# EasyEDA schematic SCH_EEE3088F-Sphora_2025-04-07.json
TITLE: Sheet_1; REV: 1.0; Date: 2025-04-07; Sheet: 1/1; Drawn By: LBTTED001; Company: Your Company
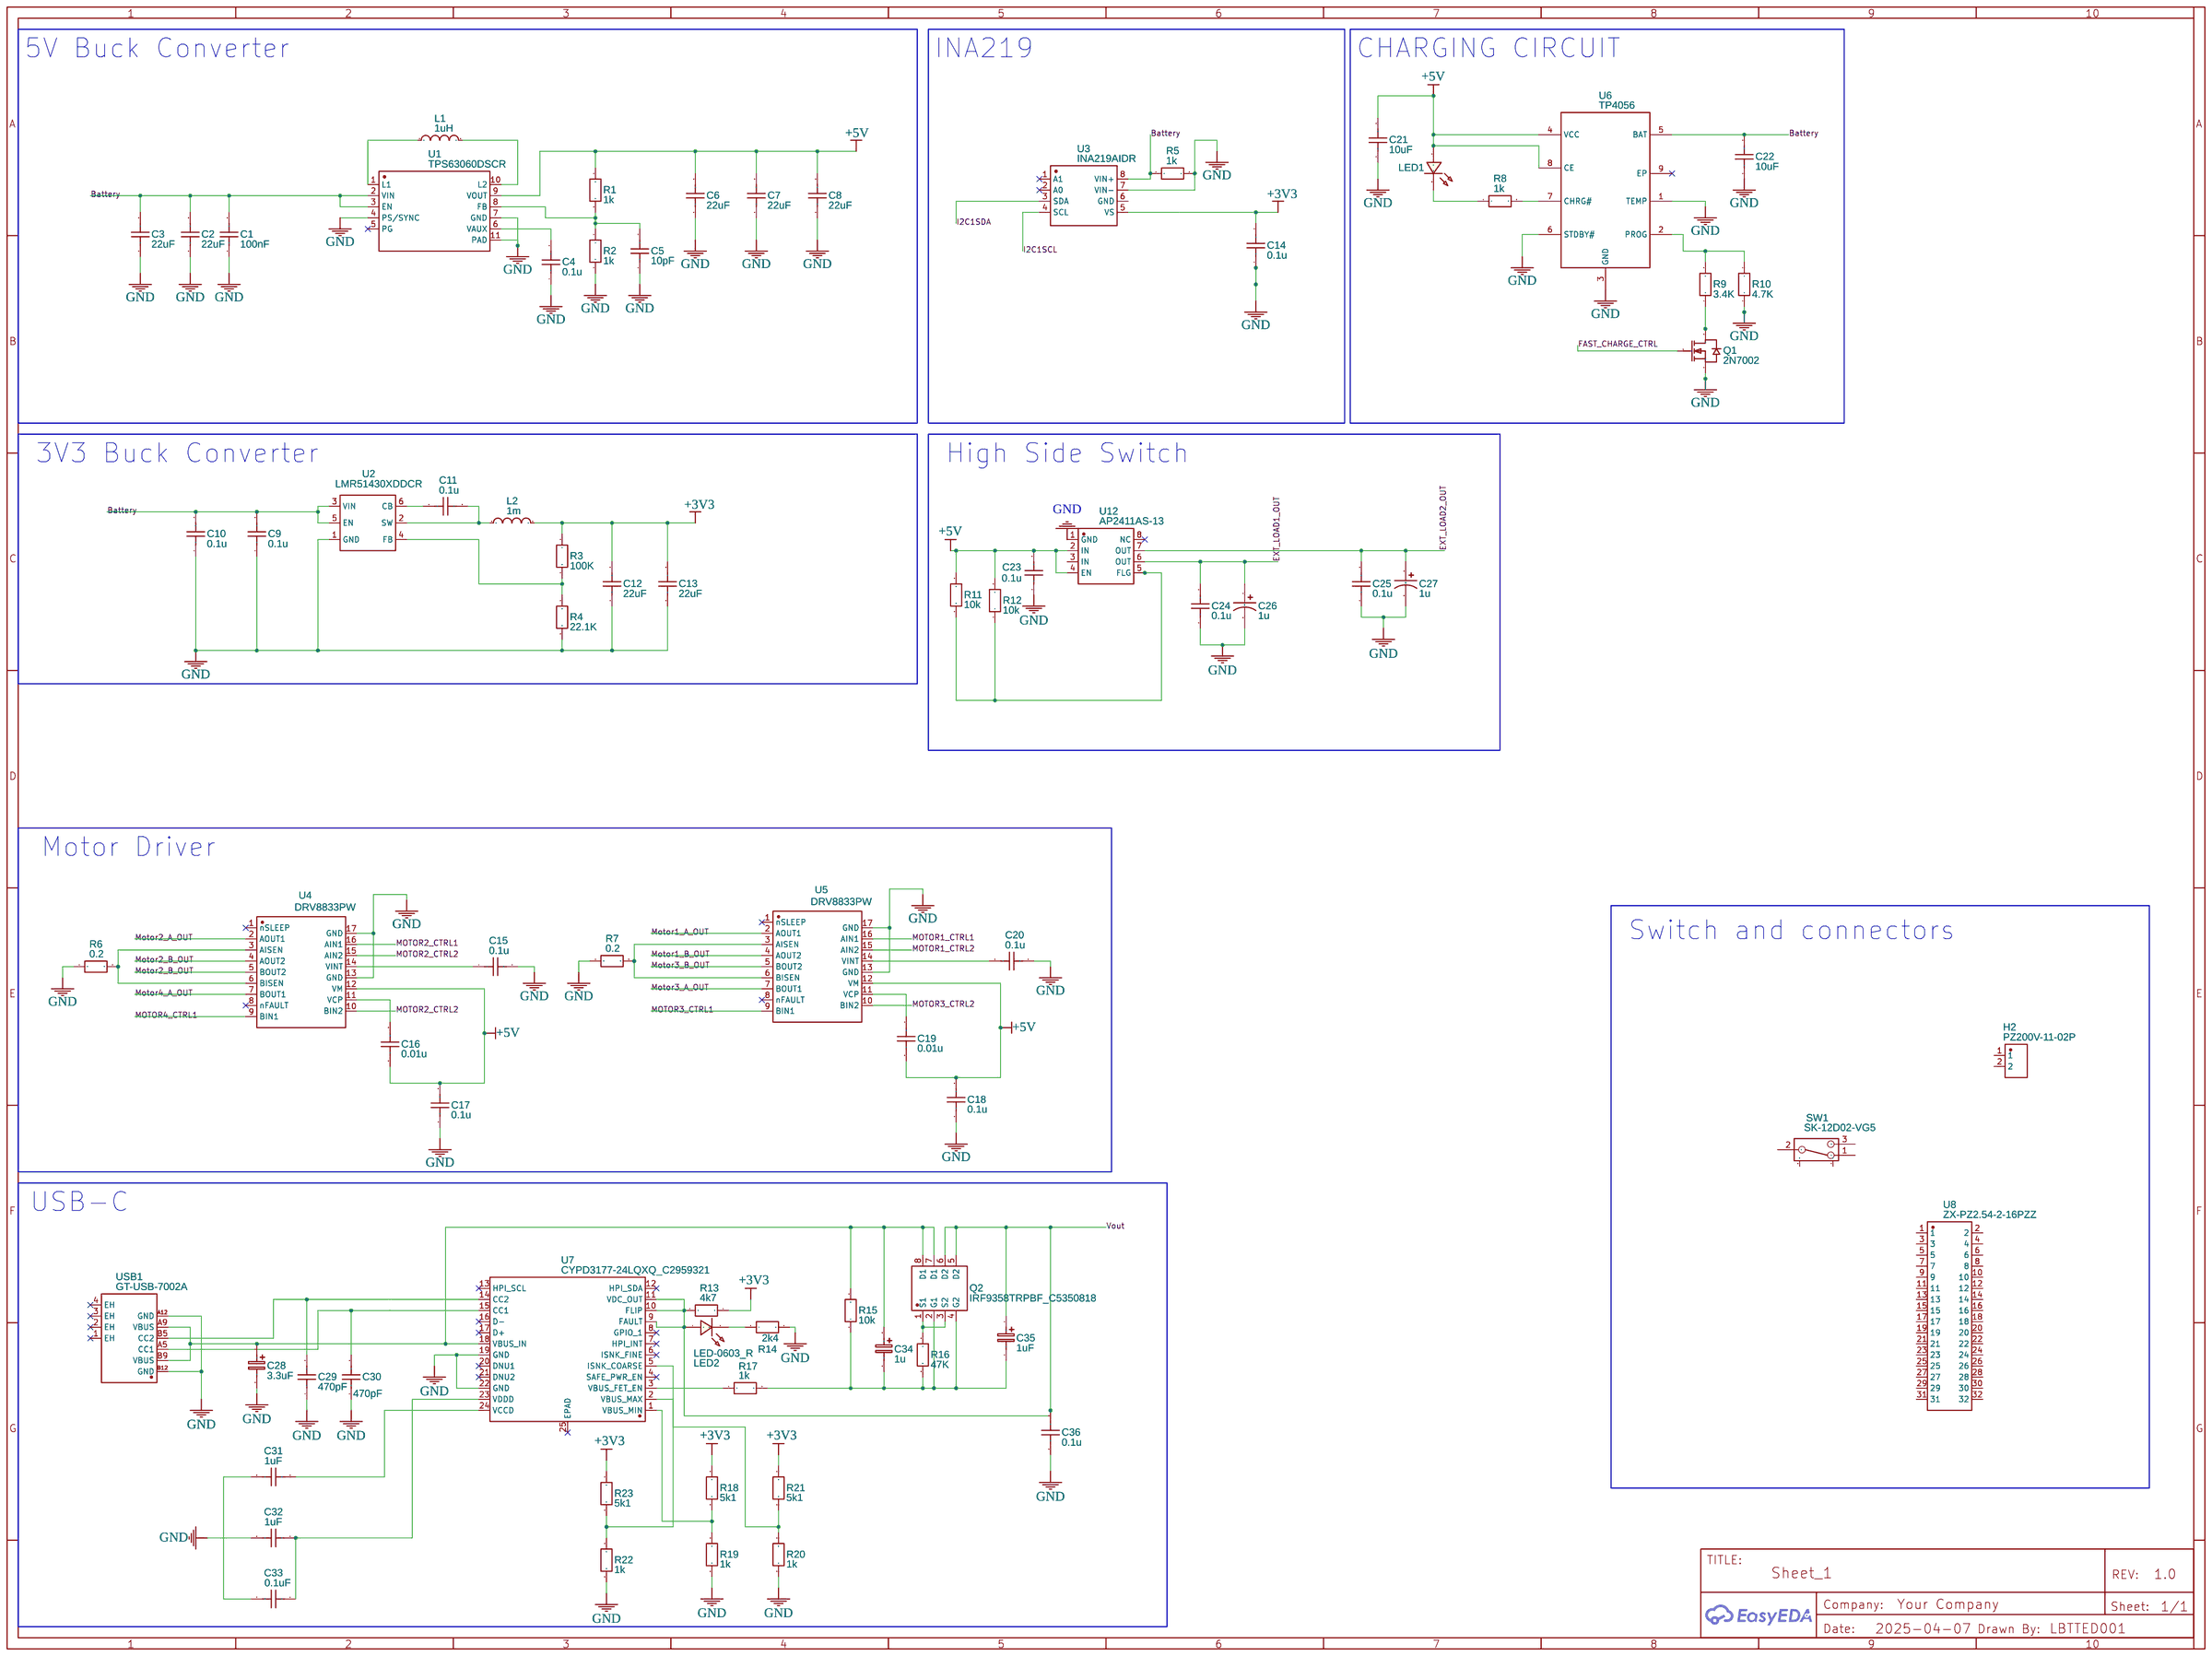
[diagram p0: schematic sheet]

## Parts
C1  100nF  [C0402]
C2  22uF  [C0402]
C3  22uF  [C0402]
C4  0.1u  [C0402]
C5  10pF  [C0402]
C6  22uF  [C0402]
C7  22uF  [C0402]
C8  22uF  [C0402]
C9  0.1u  [C0402]
C10  0.1u  [C0402]
C11  0.1u  [C0402]
C12  22uF  [C0402]
C13  22uF  [C0402]
C14  0.1u  [C0402]
C15  0.1u  [C0402]
C16  0.01u  [C0402]
C17  0.1u  [C0402]
C18  0.1u  [C0402]
C19  0.01u  [C0402]
C20  0.1u  [C0402]
C21  10uF  [C0402]
C22  10uF  [C0402]
C23  0.1u  [C0402]
C24  0.1u  [C0402]
C25  0.1u  [C0402]
C26  1u  [CASE-A_3216]
C27  1u  [CASE-A_3216]
C28  3.3uF  [CASE-A_3216]
C29  470pF  [C0402]
C30  470pF  [C0402]
C31  1uF  [C0402]
C32  1uF  [C0402]
C33  0.1uF  [C0402]
C34  1u  [CASE-A_3216]
C35  1uF  [CASE-A_3216]
C36  0.1u  [C0402]
H2  PZ200V-11-02P  [HDR-TH_2P-P2.00-V-M]
L1  1uH  [L0603]
L2  1m  [L0603]
LED1  LED-0603_R  [LED0603_RED]
LED2  LED-0603_R  [LED0603_RED]
Q1  2N7002  [SOT-23_L2.9-W1.3-P0.95-LS2.4-BR]
Q2  IRF9358TRPBF_C5350818  [SOIC-8_L4.9-W3.9-P1.27-LS6.0-BL]
R1  1k  [R0402]
R2  1k  [R0402]
R3  100K  [R0402]
R4  22.1K  [R0402]
R5  1k  [R0402]
R6  0.2  [R0402]
R7  0.2  [R0402]
R8  1k  [R0402]
R9  3.4K  [R0402]
R10  4.7K  [R0402]
R11  10k  [R0402]
R12  10k  [R0402]
R13  4k7  [R0402]
R14  2k4  [R0402]
R15  10k  [R0402]
R16  47K  [R0402]
R17  1k  [R0402]
R18  5k1  [R0402]
R19  1k  [R0402]
R20  1k  [R0402]
R21  5k1  [R0402]
R22  1k  [R0402]
R23  5k1  [R0402]
SW1  SK-12D02-VG5  [SW-TH_SK-12D02VG3]
U1  TPS63060DSCR  [WSON-10_L3.0-W3.0-P0.50-BL-EP-A]
U2  LMR51430XDDCR  [SOT-23-6_L2.9-W1.6-P0.95-LS2.8-BL]
U3  INA219AIDR  [SOIC-8_L4.9-W3.9-P1.27-LS6.0-BL]
U4  DRV8833PW  [HTSSOP-16_L5.0-W4.4-P0.65-LS6.4-TL-EP-1]
U5  DRV8833PW  [HTSSOP-16_L5.0-W4.4-P0.65-LS6.4-TL-EP-1]
U6  TP4056  [ESOP-8_L4.9-W3.9-P1.27-LS6.0-BL-EP]
U7  CYPD3177-24LQXQ_C2959321  [TQFN-24_L4.0-W4.0-P0.50-TL-EP2.8]
U8  ZX-PZ2.54-2-16PZZ  [HDR-TH_32P-P2.54-V-M-R2-C16-S2.54]
U12  AP2411AS-13  [SOP-8_L4.9-W3.9-P1.27-LS6.0-BL]
USB1  GT-USB-7002A  [USB-C-SMD_GT-USB-7002A]

## Library data of the parts
C1-C25 C29-C33 C36 = C_0402_US: Contributor: LCEDA_Lib
C26 C27 = C_Tan_SMD_A_US: Contributor: LCEDA_Lib
C28 C34 C35 = C_Tan_SMD_A_EU: Contributor: LCEDA_Lib
H2 = PZ200V-11-02P: Contributor: LCSC; Supplier: LCSC; Supplier Part: C541856; Manufacturer: XFCN(兴飞); JLCPCB Part Class: Extended Part
L1 L2 = L0603_US: Contributor: LCEDA_Lib
LED1 LED2 = LED-0603_R: Manufacturer: EVERLIGHT(台湾亿光); Manufacturer Part: 19-217/R6C-AL1M2VY/3T; Supplier Part: C72044; Supplier: LCSC; Contributor: LCEDA_01
Q1 = 2N7002: Supplier: LCSC; Manufacturer: Nexperia; Manufacturer Part: 2N7002,215; image: //image.lceda.cn/szlcsc/C65189.jpg; Supplier Part: C65189; Paste Type: expand; Contributor: LCEDA_Lib
Q2 = IRF9358TRPBF_C5350818: Contributor: lcsc; Supplier: LCSC; Supplier Part: C5350818; Manufacturer: TECH PUBLIC(台舟); Manufacturer Part: IRF9358TRPBF; JLCPCB Part Class: Extended Part
R1-R23 = R_0402_EU: Contributor: LCEDA_Lib
SW1 = SK-12D02-VG5: Supplier: LCSC; Supplier Part: C136722; Manufacturer: Rectangular Connectors - Contacts; Contributor: LCSC
U1 = TPS63060DSCR: Supplier: LCSC; Manufacturer: TI(德州仪器); Supplier Part: C48567; JLCPCB Part Class: Extended Part; Package Display: No
U2 = LMR51430XDDCR: Contributor: lcsc; Supplier: LCSC; Supplier Part: C5185863; Manufacturer: TI(德州仪器); JLCPCB Part Class: Extended Part
U3 = INA219AIDR: Contributor: LCSC; Supplier: LCSC; Manufacturer: TI(德州仪器); Supplier Part: C138706; JLCPCB Part Class: Extended Part
U4 U5 = DRV8833PW: Contributor: LCSC; Supplier: LCSC; Supplier Part: C9900006077; Manufacturer: null; JLCPCB Part Class: Extended Part
U6 = TP4056: Contributor: Guest; Supplier: LCSC; Manufacturer: TOPPOWER(南京拓微); Manufacturer Part: TP4056-42-ESOP8; Supplier Part: C16581; JLCPCB Part Class: Extended Part
U7 = CYPD3177-24LQXQ_C2959321: Supplier: LCSC; Supplier Part: C2959321; Manufacturer: Infineon/CYPRESS(赛普拉斯); Manufacturer Part: CYPD3177-24LQXQ; JLCPCB Part Class: Extended Part; Contributor: lcsc
U8 = ZX-PZ2.54-2-16PZZ: Supplier: LCSC; Supplier Part: C7501282; Manufacturer: Megastar(兆星); Contributor: lcsc
U12 = AP2411AS-13: Contributor: LCSC; Supplier: LCSC; Supplier Part: C460347; Manufacturer: DIODES(美台); JLCPCB Part Class: Extended Part
USB1 = GT-USB-7002A: Supplier: LCSC; Supplier Part: C963365; Manufacturer: G-Switch(品赞); JLCPCB Part Class: Extended Part; Contributor: lcsc

## Nets
+3V3: C12.2 C13.2 C14.1 L2.2 R3.2 R13.2 R18.1 R21.1 R23.1 U3.5(VS)
+5V: C6.2 C7.2 C8.2 C16.1 C17.2 C18.2 C19.1 C21.2 C23.2 LED1.1 R1.1 R11.2 R12.2 U1.9(VOUT) U4.12(VM) U5.12(VM) U6.4(VCC) U6.8(CE) U12.2(IN) U12.4(EN)
GND: C1.1 C2.1 C3.1 C4.1 C5.1 C6.1 C7.1 C8.1 C9.1 C10.1 C12.1 C13.1 C14.2 C15.2 C17.1 C18.1 C20.2 C21.1 C22.1 C23.1 C24.1 C25.1 C26.2 C27.2 C28.2 C29.1 C30.1 C32.2 C36.1 Q1.2(S) R2.2 R4.1 R5.2 R6.1 R7.1 R10.1 R14.2 R19.2 R20.2 R22.2 U1.4(PS/SYNC) U1.7(GND) U1.11(PAD) U2.1(GND) U3.7(VIN-) U4.13(GND) U4.17(GND) U5.13(GND) U5.17(GND) U6.1(TEMP) U6.3(GND) U6.6(STDBY#) U7.19(GND) U7.22(GND) U12.1(GND) USB1.A12(GND) USB1.B12(GND)
Battery: C1.2 C2.2 C3.2 C9.2 C10.2 C22.2 R5.1 U1.2(VIN) U1.3(EN) U2.3(VIN) U2.5(EN) U3.8(VIN+) U6.5(BAT)
EXT_LOAD1_OUT: C24.2 C26.1 U12.6(OUT)
EXT_LOAD2_OUT: C25.2 C27.1 U12.7(OUT)
FAST_CHARGE_CTRL: Q1.1(G)
I2C1SCL: U3.4(SCL)
I2C1SDA: U3.3(SDA)
Motor1_A_OUT: U5.2(AOUT1)
Motor1_B_OUT: U5.4(AOUT2)
MOTOR1_CTRL1: U5.16(AIN1)
MOTOR1_CTRL2: U5.15(AIN2)
Motor2_A_OUT: U4.2(AOUT1)
Motor2_B_OUT: U4.4(AOUT2) U4.5(BOUT2)
MOTOR2_CTRL1: U4.16(AIN1)
MOTOR2_CTRL2: U4.10(BIN2) U4.15(AIN2)
Motor3_A_OUT: U5.7(BOUT1)
Motor3_B_OUT: U5.5(BOUT2)
MOTOR3_CTRL1: U5.9(BIN1)
MOTOR3_CTRL2: U5.10(BIN2)
Motor4_A_OUT: U4.7(BOUT1)
MOTOR4_CTRL1: U4.9(BIN1)
Vout: C35.1 C36.2 LED2.1 Q2.5(D2) Q2.6(D2) R13.1 U7.9(FAULT) U7.10(FLIP) U7.11(VDC_OUT)
Net-(C4-2): C4.2 U1.6(VAUX)
Net-(C5-2): C5.2 R1.2 R2.1 U1.8(FB)
Net-(C11-1): C11.1 U2.6(CB)
Net-(C11-2): C11.2 L2.1 U2.2(SW)
Net-(C15-1): C15.1 U4.14(VINT)
Net-(C16-2): C16.2 U4.11(VCP)
Net-(C19-2): C19.2 U5.11(VCP)
Net-(C20-1): C20.1 U5.14(VINT)
Net-(C28-1): C28.1 C34.1 Q2.7(D1) Q2.8(D1) R15.2 U7.18(VBUS_IN) USB1.A9(VBUS) USB1.B9(VBUS)
Net-(C29-2): C29.2 U7.14(CC2) USB1.B5(CC2)
Net-(C30-2): C30.2 U7.15(CC1) USB1.A5(CC1)
Net-(C31-1): C31.1 U7.24(VCCD)
Net-(C31-2): C31.2 C33.2
Net-(C32-1): C32.1 C33.1 U7.23(VDDD)
Net-(C34-2): C34.2 C35.2 Q2.2(G1) Q2.4(G2) R15.1 R16.2 R17.2
Net-(L1-1): L1.1 U1.1(L1)
Net-(L1-2): L1.2 U1.10(L2)
Net-(LED1-2): LED1.2 R8.1
Net-(LED2-2): LED2.2 R14.1
Net-(Q1-3): Q1.3(D) R9.1
Net-(Q2-1): Q2.1(S1) Q2.3(S2) R16.1
Net-(R3-1): R3.1 R4.2 U2.4(FB)
Net-(R6-2): R6.2 U4.3(AISEN) U4.6(BISEN)
Net-(R7-2): R7.2 U5.3(AISEN) U5.6(BISEN)
Net-(R8-2): R8.2 U6.7(CHRG#)
Net-(R9-2): R9.2 R10.2 U6.2(PROG)
Net-(R11-1): R11.1 R12.1 U12.5(FLG)
Net-(R17-1): R17.1 U7.3(VBUS_FET_EN)
Net-(R18-2): R18.2 R19.1 U7.1(VBUS_MIN)
Net-(R20-1): R20.1 R21.2 U7.2(VBUS_MAX)
Net-(R22-1): R22.1 R23.2 U7.5(ISNK_COARSE)

Not connected (* = marked no-connect by the designer): H2 1 2; SW1 1 2 3 4 5; U1 5(PG)*; U3 1(A1)* 2(A0)* 6(GND); U4 1(nSLEEP)* 8(nFAULT)*; U5 1(nSLEEP)* 8(nFAULT)*; U6 9(EP)*; U7 4(SAFE_PWR_EN)* 6(ISNK_FINE)* 7(HPI_INT)* 8(GPIO_1)* 12(HPI_SDA)* 13(HPI_SCL)* 16(D-)* 17(D+)* 20(DNU1)* 21(DNU2)* 25(EPAD)*; U8 1 2 3 4 5 6 7 8 9 10 11 12 13 14 15 16 17 18 19 20 21 22 23 24 25 26 27 28 29 30 31 32; U12 3(IN) 8(NC)*; USB1 1(EH)* 2(EH)* 3(EH)* 4(EH)*

## Notes on the sheet
- 5V Buck Converter
- INA219
- CHARGING CIRCUIT
- 3V3 Buck Converter
- High Side Switch
- Motor Driver
- Switch and connectors
- USB-C
